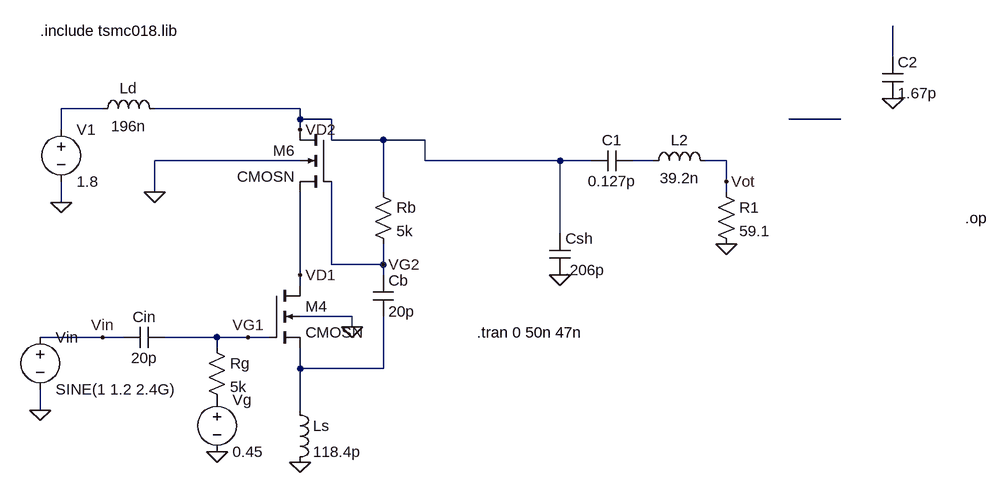
[diagram p0: schematic Self_Biased_Class_E.asc]
Self_Biased_Class_E.asc, the LTspice schematic file:
Version 4
SHEET 1 880 792
WIRE 544 -64 544 -112
WIRE -672 16 -736 16
WIRE -368 16 -592 16
WIRE -368 32 -368 16
WIRE -320 32 -368 32
WIRE 464 32 384 32
WIRE -736 48 -736 16
WIRE -368 48 -368 32
WIRE -320 64 -320 32
WIRE -240 64 -320 64
WIRE -176 64 -240 64
WIRE -368 96 -592 96
WIRE -176 96 -176 64
WIRE 32 96 -176 96
WIRE 80 96 32 96
WIRE 176 96 144 96
WIRE 288 96 256 96
WIRE 288 128 288 96
WIRE -592 144 -592 96
WIRE -240 144 -240 64
WIRE 288 144 288 128
WIRE -736 160 -736 128
WIRE 32 208 32 96
WIRE -320 256 -320 128
WIRE -240 256 -240 224
WIRE -240 256 -320 256
WIRE -368 272 -368 144
WIRE -240 272 -240 256
WIRE -368 288 -368 272
WIRE -288 336 -368 336
WIRE -288 352 -288 336
WIRE -672 368 -768 368
WIRE -640 368 -672 368
WIRE -496 368 -576 368
WIRE -448 368 -496 368
WIRE -416 368 -448 368
WIRE -496 384 -496 368
WIRE -368 416 -368 384
WIRE -240 416 -240 336
WIRE -240 416 -368 416
WIRE -768 480 -768 448
WIRE -368 480 -368 416
FLAG -368 560 0
FLAG -768 480 0
FLAG -736 160 0
FLAG 544 0 0
FLAG 288 224 0
FLAG 32 272 0
FLAG -288 352 0
FLAG -592 144 0
FLAG -368 48 VD2
FLAG -240 256 VG2
FLAG -448 368 VG1
FLAG -368 272 VD1
FLAG -496 544 0
FLAG 288 128 Vot
FLAG -672 368 Vin
SYMBOL voltage -736 32 R0
WINDOW 123 0 0 Left 0
WINDOW 39 0 0 Left 0
SYMATTR InstName V1
SYMATTR Value 1.8
SYMBOL voltage -768 352 R0
WINDOW 123 0 0 Left 0
WINDOW 39 0 0 Left 0
SYMATTR InstName Vin
SYMATTR Value SINE(1 1.2 2.4G)
SYMBOL ind -576 32 M270
WINDOW 0 32 56 VTop 2
WINDOW 3 5 56 VBottom 2
SYMATTR InstName Ld
SYMATTR Value 196n
SYMBOL ind -384 464 R0
SYMATTR InstName Ls
SYMATTR Value 118.4p
SYMBOL cmosn -416 288 R0
SYMATTR InstName M4
SYMATTR Value2 l=0.18u w=6u m=19
SYMBOL cmosn -320 48 M0
SYMATTR InstName M6
SYMATTR Value2 l=0.18u w=6u m=19
SYMBOL res -256 128 R0
SYMATTR InstName Rb
SYMATTR Value 5k
SYMBOL cap -256 272 R0
SYMATTR InstName Cb
SYMATTR Value 20p
SYMBOL cap 144 80 R90
WINDOW 0 0 32 VBottom 2
WINDOW 3 32 32 VTop 2
SYMATTR InstName C1
SYMATTR Value 0.127p
SYMBOL cap 16 208 R0
SYMATTR InstName Csh
SYMATTR Value .206p
SYMBOL cap 528 -64 R0
SYMATTR InstName C2
SYMATTR Value 1.67p
SYMBOL ind 160 112 R270
WINDOW 0 32 56 VTop 2
WINDOW 3 5 56 VBottom 2
SYMATTR InstName L2
SYMATTR Value 39.2n
SYMBOL res 272 128 R0
SYMATTR InstName R1
SYMATTR Value 59.1
SYMBOL res -512 368 R0
SYMATTR InstName Rg
SYMATTR Value 5k
SYMBOL voltage -496 448 R0
SYMATTR InstName Vg
SYMATTR Value 0.45
SYMBOL cap -576 352 R90
WINDOW 0 0 32 VBottom 2
WINDOW 3 32 32 VTop 2
SYMATTR InstName Cin
SYMATTR Value 20p
TEXT -768 -104 Left 2 !.include tsmc018.lib
TEXT -96 360 Left 2 !.tran 0 50n 47n
TEXT 656 184 Left 2 !.op

The netlist it stands for:
* Self_Biased_Class_E.asc
V1 N002 0 1.8
Vin Vin 0 SINE(1 1.2 2.4G)
Ld VD2 N002 196n
Ls N005 0 118.4p
M4 VD1 VG1 N005 0 CMOSN l=0.18u w=6u m=19
M6 VD2 VG2 VD1 0 CMOSN l=0.18u w=6u m=19
Rb VD2 VG2 5k
Cb VG2 N005 20p
C1 N004 VD2 0.127p
Csh VD2 0 .206p
C2 N001 0 1.67p
L2 N004 Vot 39.2n
R1 Vot 0 59.1
Rg VG1 P001 5k
Vg P001 0 0.45
Cin VG1 Vin 20p
.model NMOS NMOS
.model PMOS PMOS
.lib standard.mos
.include tsmc018.lib
.tran 0 50n 47n
.op
.backanno
.end